# EAGLE design Anchor PCB V1 (EAGLE 9.3.0)
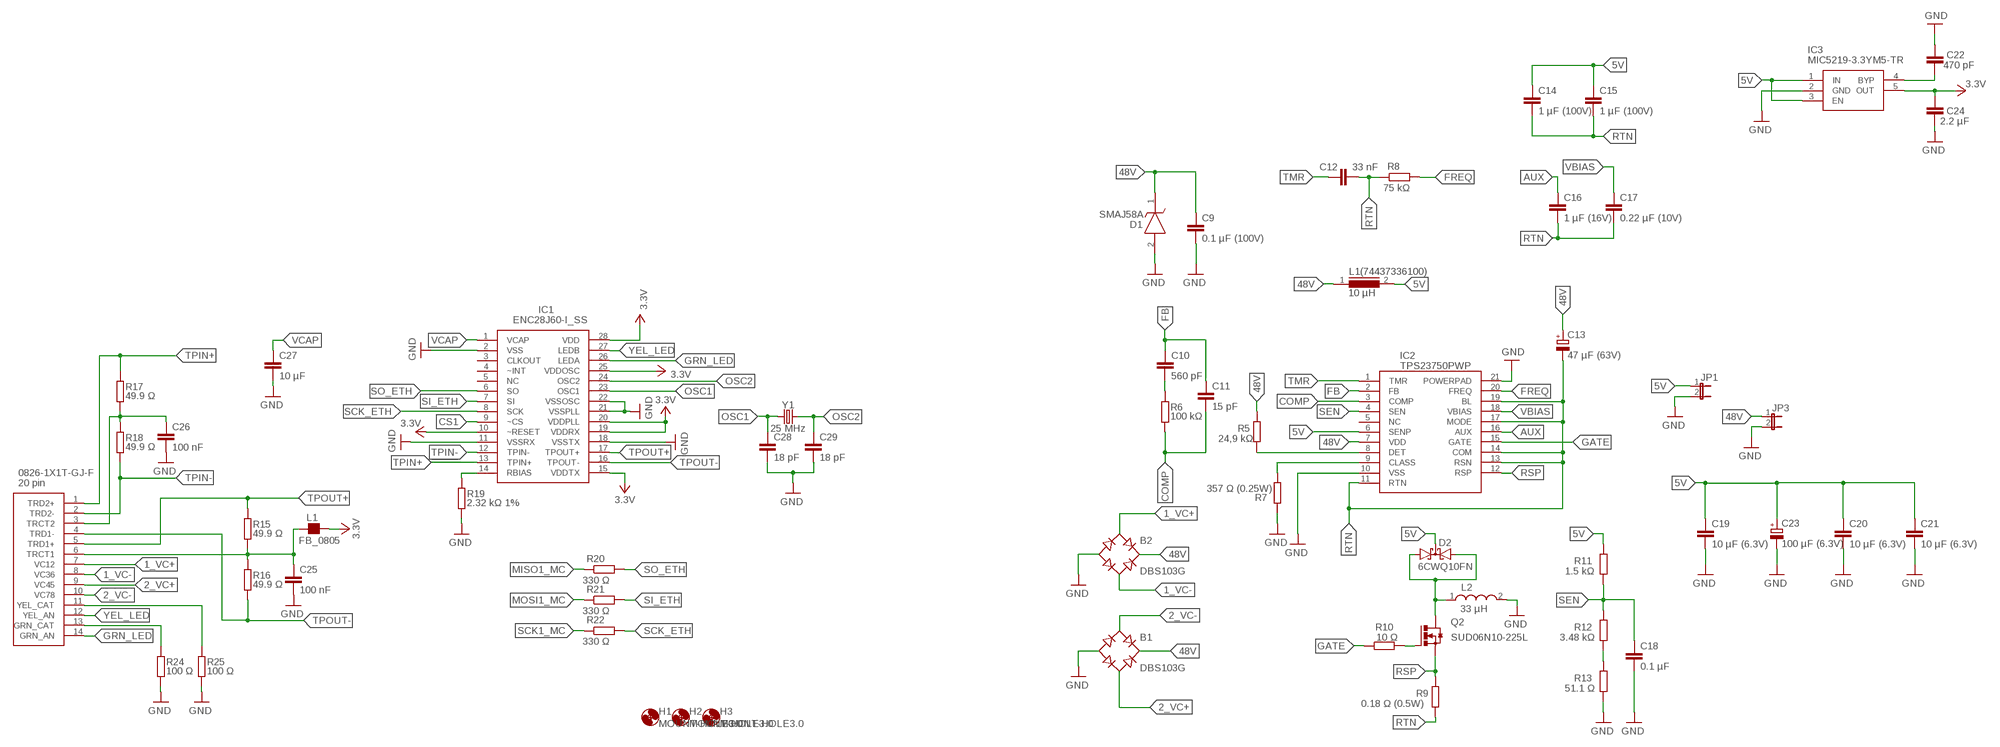
[diagram p0: schematic, sheet 1, part 1 of 2]
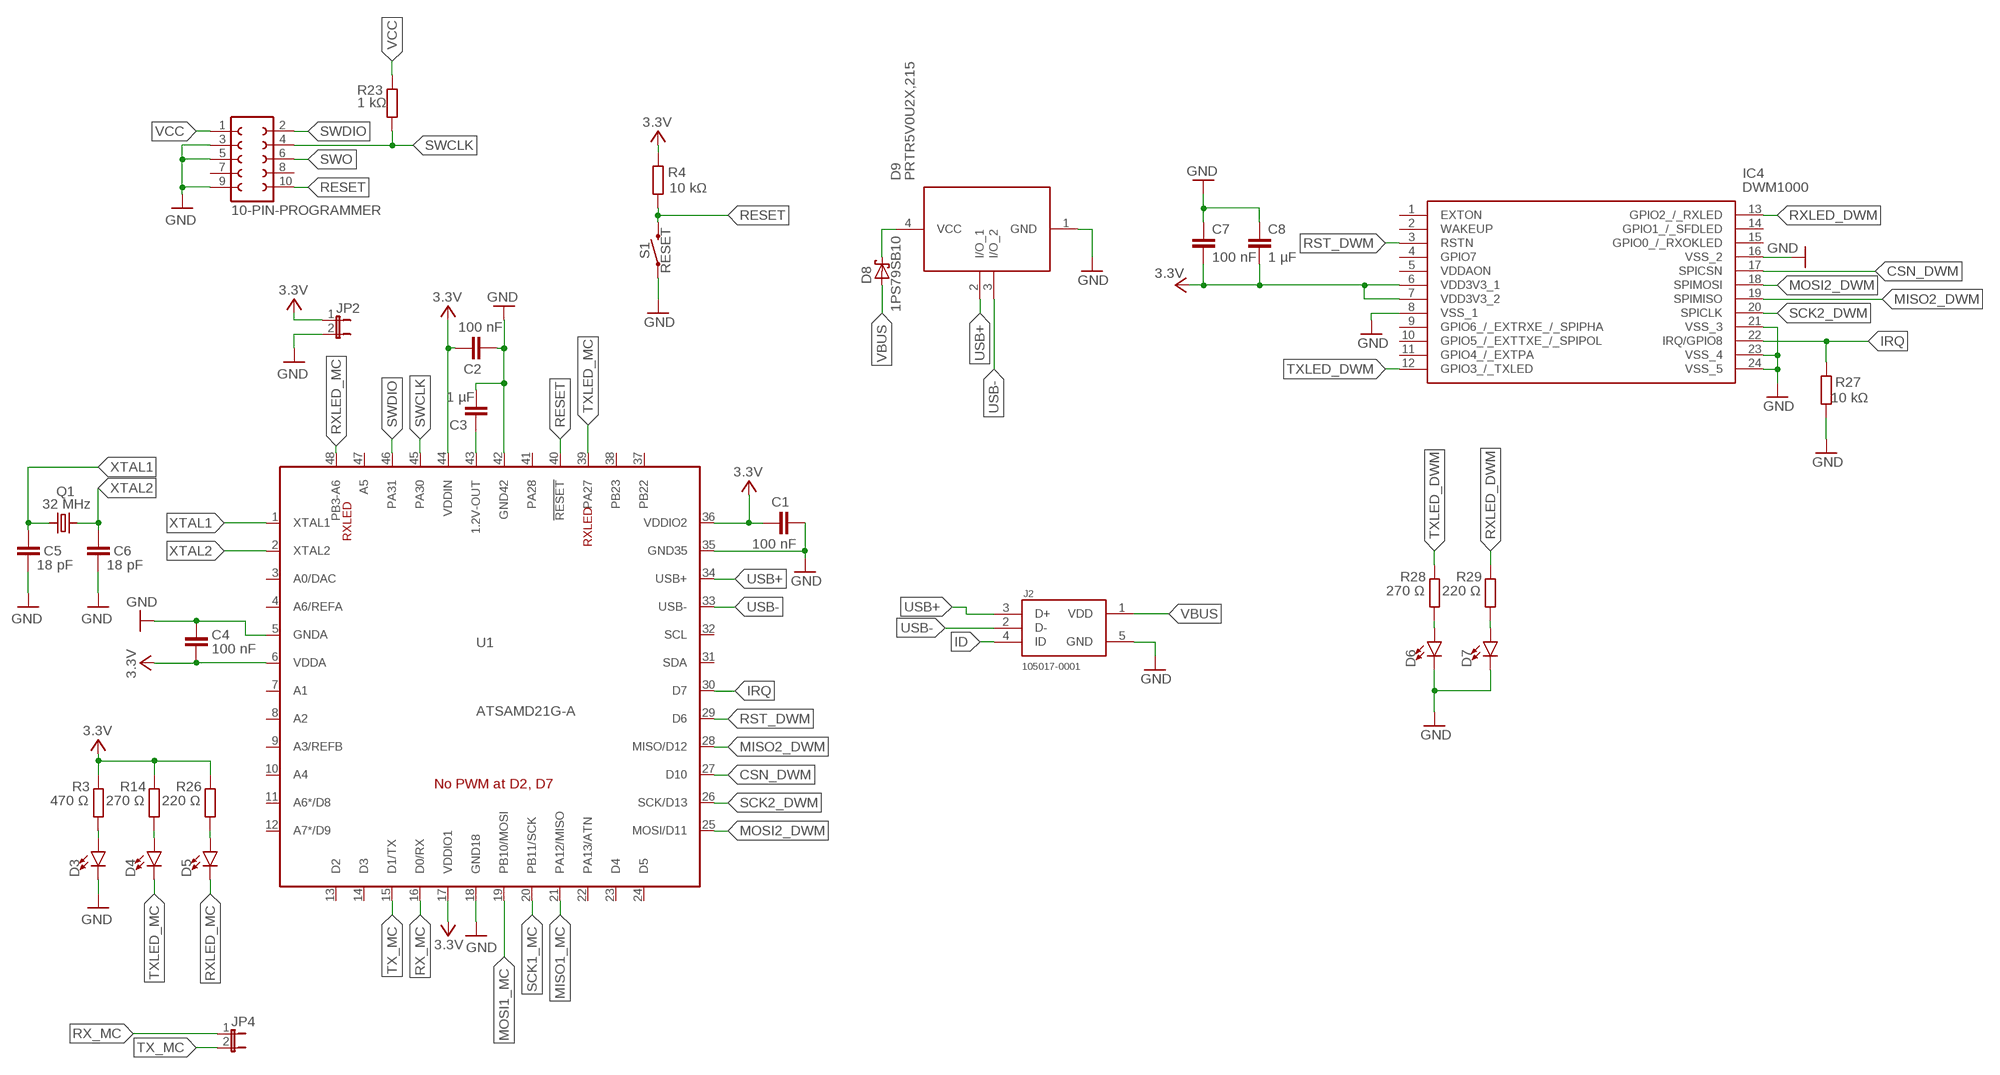
[diagram p1: schematic, sheet 1, part 2 of 2]

## Parts
10-PIN-PROGRAMMER  FE05-2  [FE05-2]
B1  DBS103G  [DBS]
B2  DBS103G  [DBS]
C1  100 nF  C-EUC0805  [C0805]
C2  100 nF  C-EUC0805  [C0805]
C3  1 µF  C-EUC0805  [C0805]
C4  100 nF  C-EUC0805  [C0805]
C5  18 pF  C-EUC0805  [C0805]
C6  18 pF  C-EUC0805  [C0805]
C7  100 nF  C-EUC0805  [C0805]
C8  1 µF  C-EUC0805  [C0805]
C9  0.1 µF (100V)  C-EUC0805  [C0805]
C10  560 pF  C-EUC0805  [C0805]
C11  15 pF  C-EUC0805  [C0805]
C12  33 nF  C-EUC0805  [C0805]
C13  47 µF (63V)  CPOL-EUE3.5-8  [E3,5-8]
C14  1 µF (100V)  C-EUC0805  [C0805]
C15  1 µF (100V)  C-EUC0805  [C0805]
C16  1 µF (16V)  C-EUC0805  [C0805]
C17  0.22 µF (10V)  C-EUC0805  [C0805]
C18  0.1 µF  C-EUC0805  [C0805]
C19  10 µF (6.3V)  C-EUC0805  [C0805]
C20  10 µF (6.3V)  C-EUC0805  [C0805]
C21  10 µF (6.3V)  C-EUC0805  [C0805]
C22  470 pF  C-EUC0805  [C0805]
C23  100 µF (6.3V)  CPOL-EUUD-6,3X7,7  [UD-6,3X7,7_NICHICON]
C24  2.2 µF  C-EUC0805  [C0805]
C25  100 nF  C-EUC0805  [C0805]
C26  100 nF  C-EUC0805  [C0805]
C27  10 µF  C-EUC0805  [C0805]
C28  18 pF  C-EUC0805  [C0805]
C29  18 pF  C-EUC0805  [C0805]
D1  SMAJ58A  [DIOM5026X229N]
D2  6CWQ10FN  BAS70-05DPAK  [DPAK]
D3  POWER  LEDCHIP-LED0805  [CHIP-LED0805]
D4  TX  LEDCHIP-LED0805  [CHIP-LED0805]
D5  RX  LEDCHIP-LED0805  [CHIP-LED0805]
D6  TX  LEDCHIP-LED0805  [CHIP-LED0805]
D7  RX  LEDCHIP-LED0805  [CHIP-LED0805]
D8  1PS79SB10  [SOD523]
D9  PRTR5V0U2X,215  [SOT-143B]
H1  MOUNT-HOLE3.0  [3,0]
H2  MOUNT-HOLE3.0  [3,0]
H3  MOUNT-HOLE3.0  [3,0]
IC1  ENC28J60-I_SS  [SOP65P780X200-28N]
IC2  TPS23750PWP  [SOP65P640X120-21N]
IC3  MIC5219-3.3YM5-TR  [SOT95P280X130-5N]
IC4  DWM1000  [DWM1000]
J1  0826-1X1T-GJ-F  [0826-1X1T-GJ-F]
J2  105017-0001  [MOLEX_105017-0001]
JP1  JP1E  [JP1]
JP2  JP1E  [JP1]
JP3  JP1E  [JP1]
JP4  JP1E  [JP1]
L1  FB_0805  [L0805]
L1(74437336100)  10 µH  DR73  [DR73]
L2  33 µH  WE-PD_1260/1245/1280/1210  [WE-PD_1260/1245/1280/1210]
Q1  32 MHz  CRYSTAL.ABS07  [ABS07]
Q2  SUD06N10-225L  N-HEXFET_SOT323-IRLL014N  [SOT223]
R3  470 Ω  R-EU_R0805  [R0805]
R4  10 kΩ  R-EU_M0805  [M0805]
R5  24,9 kΩ  R-EU_R0805  [R0805]
R6  100 kΩ  R-EU_R0805  [R0805]
R7  357 Ω (0.25W)  R-EU_R0805  [R0805]
R8  75 kΩ  R-EU_R0805  [R0805]
R9  0.18 Ω (0.5W)  R-EU_R2010  [R2010]
R10  10 Ω  R-EU_R0805  [R0805]
R11  1.5 kΩ  R-EU_R0805  [R0805]
R12  3.48 kΩ  R-EU_R0805  [R0805]
R13  51.1 Ω  R-EU_R0805  [R0805]
R14  270 Ω  R-EU_R0805  [R0805]
R15  49.9 Ω  R-EU_R0805  [R0805]
R16  49.9 Ω  R-EU_R0805  [R0805]
R17  49.9 Ω  R-EU_R0805  [R0805]
R18  49.9 Ω  R-EU_R0805  [R0805]
R19  2.32 kΩ 1%  R-EU_R0805  [R0805]
R20  330 Ω  R-EU_R0805  [R0805]
R21  330 Ω  R-EU_R0805  [R0805]
R22  330 Ω  R-EU_R0805  [R0805]
R23  1 kΩ  R-EU_R0805  [R0805]
R24  100 Ω  R-EU_R0805  [R0805]
R25  100 Ω  R-EU_R0805  [R0805]
R26  220 Ω  R-EU_R0805  [R0805]
R27  10 kΩ  R-EU_M0805  [M0805]
R28  270 Ω  R-EU_R0805  [R0805]
R29  220 Ω  R-EU_R0805  [R0805]
S1  RESET  MOMENTARY-SWITCH-SPST-SMD-4.5MM  [TACTILE_SWITCH_SMD_4.5MM]
U1  ATSAMD21G-A  [TQFP-48]
Y1  25 MHz  CRYSTALSMD-HC49UP  [HC49UP]

## Nets
1_VC+: B2.AC1 J1.7(VC12)
1_VC-: B2.AC2 J1.8(VC36)
2_VC+: B1.AC2 J1.9(VC45)
2_VC-: B1.AC1 J1.10(VC78)
5V: C14.1 C15.1 C19.1 C20.1 C21.1 C23.+ D2.4(C) IC2.6(SENP) IC3.1(IN) IC3.3(EN) JP1.1 L1(74437336100).2 R11.2
48V: B1.+ B2.+ C9.1 C13.+ D1.1(K) IC2.7(VDD) JP3.1 L1(74437336100).1 R5.2
AUX: C16.1 IC2.16(AUX)
COM_A_SHTKY: D2.1(A1) D2.3(A2) L2.1 Q2.4(D)
COMP: C11.2 IC2.3(COMP) R6.2
CS1: IC1.9(~CS)
CSN_DWM: IC4.17(SPICSN) U1.27(D10)
FB: C10.1 C11.1 IC2.2(FB)
FREQ: IC2.20(FREQ) R8.2
GATE: IC2.15(GATE) R10.1
GND: 10-PIN-PROGRAMMER.3 10-PIN-PROGRAMMER.5 10-PIN-PROGRAMMER.9 B1.- B2.- C1.2 C2.2 C3.2 C4.2 C5.2 C6.2 C7.1 C8.1 C9.2 C18.2 C19.2 C20.2 C21.2 C22.1 C23.- C24.2 C25.2 C26.2 C27.2 C28.2 C29.2 D1.2(A) D3.C D6.C D7.C D9.1(GND) IC1.2(VSS) IC1.11(VSSRX) IC1.18(VSSTX) IC1.21(VSSPLL) IC1.22(VSSOSC) IC2.10(VSS) IC2.21(POWERPAD) IC3.2(GND) IC4.8(VSS_1) IC4.16(VSS_2) IC4.21(VSS_3) IC4.23(VSS_4) IC4.24(VSS_5) J2.5(GND) JP1.2 JP2.2 JP3.2 L2.2 R7.1 R13.1 R19.2 R24.2 R25.2 R27.1 S1.2 S1.3 U1.5(GNDA) U1.18(GND18) U1.35(GND35) U1.42(GND42)
GRN_CAT: J1.13(GRN_CAT) R24.1
GRN_LED: IC1.26(LEDA) J1.14(GRN_AN)
ID: J2.4(ID)
IRQ: IC4.22(IRQ/GPIO8) R27.2 U1.30(D7)
MISO1_MC: R20.1 U1.21(PA12/MISO)
MISO2_DWM: IC4.19(SPIMISO) U1.28(MISO/D12)
MOSI1_MC: R21.1 U1.19(PB10/MOSI)
MOSI2_DWM: IC4.18(SPIMOSI) U1.25(MOSI/D11)
N$1: C3.1 U1.43(1.2V-OUT)
N$2: IC2.8(DET) R5.1
N$3: IC2.9(CLASS) R7.2
N$4: C25.1 J1.6(TRCT1) L1.1 R15.2 R16.1
N$5: C10.2 R6.1
N$6: C26.1 J1.3(TRCT2) R17.2 R18.1
N$7: Q2.1(G) R10.2
N$8: IC1.14(RBIAS) R19.1
N$9: D3.A R3.1
N$10: R12.1 R13.2
N$11: D4.A R14.1
N$12: D5.A R26.1
N$13: D6.A R28.1
N$14: D7.A R29.1
N$15: D8.1(K) D9.4(VCC)
N$18: C22.2 IC3.4(BYP)
OSC1: C28.1 IC1.23(OSC1) Y1.1
OSC2: C29.1 IC1.24(OSC2) Y1.2
RESET: 10-PIN-PROGRAMMER.10 R4.1 S1.1 S1.4 U1.40(!RESET!)
RSP: IC2.12(RSP) Q2.3(S) R9.2
RST_DWM: IC4.3(RSTN) U1.29(D6)
RTN: C12.2 C13.- C14.2 C15.2 C16.2 C17.2 IC2.11(RTN) IC2.13(RSN) IC2.14(COM) IC2.17(MODE) IC2.19(BL) R8.1 R9.1
RX_MC: JP4.1 U1.16(D0/RX)
RXLED_DWM: IC4.13(GPIO2_/_RXLED) R29.2
RXLED_MC: D5.C U1.48(PB3-A6)
SCK1_MC: R22.1 U1.20(PB11/SCK)
SCK2_DWM: IC4.20(SPICLK) U1.26(SCK/D13)
SCK_ETH: IC1.8(SCK) R22.2
SEN: C18.1 IC2.4(SEN) R11.1 R12.2
SI_ETH: IC1.7(SI) R21.2
SO_ETH: IC1.6(SO) R20.2
SWCLK: 10-PIN-PROGRAMMER.4 R23.1 U1.45(PA30)
SWDIO: 10-PIN-PROGRAMMER.2 U1.46(PA31)
SWO: 10-PIN-PROGRAMMER.6
TMR: C12.1 IC2.1(TMR)
TPIN+: IC1.13(TPIN+) J1.1(TRD2+) R17.1
TPIN-: IC1.12(TPIN-) J1.2(TRD2-) R18.2
TPOUT+: IC1.17(TPOUT+) J1.5(TRD1+) R15.1
TPOUT-: IC1.16(TPOUT-) J1.4(TRD1-) R16.2
TX_MC: JP4.2 U1.15(D1/TX)
TXLED_DWM: IC4.12(GPIO3_/_TXLED) R28.2
TXLED_MC: D4.C U1.39(PA27)
USB+: D9.2(I/O_1) J2.3(D+) U1.34(USB+)
USB-: D9.3(I/O_2) J2.2(D-) U1.33(USB-)
VBIAS: C17.1 IC2.18(VBIAS)
VBUS: D8.2(A) J2.1(VDD)
VCAP: C27.1 IC1.1(VCAP)
VCC: 10-PIN-PROGRAMMER.1 C1.1 C2.1 C4.1 C7.2 C8.2 C24.1 IC1.10(~RESET) IC1.15(VDDTX) IC1.19(VDDRX) IC1.20(VDDPLL) IC1.25(VDDOSC) IC1.28(VDD) IC3.5(OUT) IC4.6(VDD3V3_1) IC4.7(VDD3V3_2) JP2.1 L1.2 R3.2 R4.2 R14.2 R23.2 R26.2 U1.6(VDDA) U1.17(VDDIO1) U1.36(VDDIO2) U1.44(VDDIN) ; supply symbol labelled 3.3V
XTAL1: C5.1 Q1.2 U1.1(XTAL1)
XTAL2: C6.1 Q1.1 U1.2(XTAL2)
YEL_CAT: J1.11(YEL_CAT) R25.1
YEL_LED: IC1.27(LEDB) J1.12(YEL_AN)
Unconnected: 10-PIN-PROGRAMMER.7 10-PIN-PROGRAMMER.8 IC1.3(CLKOUT) IC1.4(~INT) IC1.5(NC) IC2.5(NC) IC4.1(EXTON) IC4.2(WAKEUP) IC4.4(GPIO7) IC4.5(VDDAON) IC4.9(GPIO6_/_EXTRXE_/_SPIPHA) IC4.10(GPIO5_/_EXTTXE_/_SPIPOL) IC4.11(GPIO4_/_EXTPA) IC4.14(GPIO1_/_SFDLED) IC4.15(GPIO0_/_RXOKLED) U1.3(A0/DAC) U1.4(A6/REFA) U1.7(A1) U1.8(A2) U1.9(A3/REFB) U1.10(A4) U1.11(A6*/D8) U1.12(A7*/D9) U1.13(D2) U1.14(D3) U1.22(PA13/ATN) U1.23(D4) U1.24(D5) U1.31(SDA) U1.32(SCL) U1.37(PB22) U1.38(PB23) U1.41(PA28) U1.47(A5)

## Library data of the parts
10-PIN-PROGRAMMER = con-lsta:FE05-2: FEMALE HEADER; OC_FARNELL: unknown; OC_NEWARK: unknown
B1 B2 = rectifier:DB?*G: Single Phase 1.0 AMP Glass Passivated Bridge Rectifier Taiwan Semiconductor Co.,Ltd. - TSC Source: http://www.taiwansemi.com/TSCbig5/ezcatfiles/cust/img/img/db101g.pdf http://www.ts.com.tw/db/pictures/modules/PDT/PDT060207001/DBLS201G.pdf
C1-C12 C14-C22 C24-C29 = rcl:C-EU: CAPACITOR, European symbol; SPICEPREFIX: C
C13 C23 = rcl:CPOL-EU: POLARIZED CAPACITOR, European symbol; SPICEPREFIX: C
D1 = SMAJ58A:SMAJ58A: Littelfuse SMAJ58A Uni-Directional TVS Diode, 400W peak, 2-Pin DO-214AC Source: Datasheet <https://componentsearchengine.com/Datasheets/2/SMAJ58A.pdf>; DESCRIPTION: Littelfuse SMAJ58A Uni-Directional TVS Diode, 400W peak, 2-Pin DO-214AC; HEIGHT: 2.29mm; MANUFACTURER_NAME: LITTELFUSE; MANUFACTURER_PART_NUMBER: SMAJ58A; MOUSER_PART_NUMBER: 576-SMAJ58A; MOUSER_PRICE-STOCK: https://www.mouser.com/Search/Refine.aspx?Keyword=576-SMAJ58A; RS_PART_NUMBER: 7645562P; RS_PRICE-STOCK: http://uk.rs-online.com/web/p/products/7645562P
D2 = shottky:BAS70-05: Silicon Schottky Diodes General-purpose diode for high-speed switching
D3-D7 = led:LED: LED OSRAM: - CHIPLED LG R971, LG N971, LY N971, LG Q971, LY Q971, LO R971, LY R971 LH N974, LH R974 LS Q976, LO Q976, LY Q976 LO Q996 - Hyper CHIPLED LW Q18S LB Q993, LB Q99A, LB R99A - SideLED LS A670, LO A670, LY A670, LG A670, LP A670 LB A673, LV A673, LT A673, LW A673 LH A674 LY A675 LS A676, LA A676, LO A676, LY A676, LW A676 LS A679, LY A679, LG A679 - Hyper Micro SIDELED® LS Y876, LA Y876, LO Y876, LY Y876 LT Y87S - SmartLED LW L88C, LW L88S LB L89C, LB L89S, LG L890 LS L89K, LO L89K, LY L89K LS L896, LA L896, LO L896, LY L896 - TOPLED LS T670, LO T670, LY T670, LG T670, LP T670 LSG T670, LSP T670, LSY T670, LOP T670, LYG T670 LG T671, LOG T671, LSG T671 LB T673, LV T673, LT T673, LW T673 LH T674 LS T676, LA T676, LO T676, LY T676, LB T676, LH T676, LSB T676, LW T676 LB T67C, LV T67C, LT T67C, LS T67K, LO T67K, LY T67K, LW E67C LS E67B, LA E67B, LO E67B, LY E67B, LB E67C, LV E67C, LT E67C LW T67C LS T679, LY T679, LG T679 LS T770, LO T770, LY T770, LG T770, LP T770 LB T773, LV T773, LT T773, LW T773 LH T774 LS E675, LA E675, LY E675, LS T675 LS T776, LA T776, LO T776, LY T776, LB T776 LHGB T686 LT T68C, LB T68C - Hyper Mini TOPLED® LB M676 - Mini TOPLED Santana® LG M470 LS M47K, LO M47K, LY M47K Source: http://www.osram.convergy.de LUXEON: - LUMILED® LXK2-PW12-R00, LXK2-PW12-S00, LXK2-PW14-U00, LXK2-PW14-V00 LXK2-PM12-R00, LXK2-PM12-S00, LXK2-PM14-U00 LXK2-PE12-Q00, LXK2-PE12-R00, LXK2-PE12-S00, LXK2-PE14-T00, LXK2-PE14-U00 LXK2-PB12-K00, LXK2-PB12-L00, LXK2-PB12-M00, LXK2-PB14-N00, LXK2-PB14-P00, LXK2-PB14-Q00 LXK2-PR12-L00, LXK2-PR12-M00, LXK2-PR14-Q00, LXK2-PR14-R00 LXK2-PD12-Q00, LXK2-PD12-R00, LXK2-PD12-S00 LXK2-PH12-R00, LXK2-PH12-S00 LXK2-PL12-P00, LXK2-PL12-Q00, LXK2-PL12-R00 Source: www.luxeon.com KINGBRIGHT: KA-3528ASYC Source: www.kingbright.com
D8 = nxp_60_1_1:1PS79SB10: Schottky barrier diode Planar Schottky barrier diode encapsulated in a SC-79 ultra small plastic SMD package. AAL Eindhoven MK
D9 = PRTR5V0U2X_215:PRTR5V0U2X,215: ESD Protection Diodes 5.5V Dual SOT143B NXP PRTR5V0U2X,215 Dual Uni-Directional TVS Diode, 4-Pin SOT-143B Source: Datasheet <http://docs-emea.rs-online.com/webdocs/0f75/0900766b80f751d4.pdf>; DESCRIPTION: ESD Protection Diodes 5.5V Dual SOT143B NXP PRTR5V0U2X,215 Dual Uni-Directional TVS Diode, 4-Pin SOT-143B; HEIGHT: mm; MANUFACTURER_NAME: Nexperia; MANUFACTURER_PART_NUMBER: PRTR5V0U2X,215; MOUSER_PART_NUMBER: 771-PRTR5V0U2X-T/R; MOUSER_PRICE-STOCK: https://www.mouser.com/Search/Refine.aspx?Keyword=771-PRTR5V0U2X-T%2FR; RS_PART_NUMBER: 7258720P; RS_PRICE-STOCK: http://uk.rs-online.com/web/p/products/7258720P
H1-H3 = holes:MOUNT-HOLE: MOUNTING HOLE with drill center marker
IC1 = ENC28J60-I_SS:ENC28J60-I_SS: Stand-Alone Ethernet Controller Source: Datasheet <http://componentsearchengine.com/Datasheets/3/ENC28J60-I_SS.pdf>; ALLIED_NUMBER: 70047510; ALLIED_PRICE-STOCK: https://www.alliedelec.com/microchip-technology-inc-enc28j60-i-ss/70047510/; ARROW_PART_NUMBER: ENC28J60-I/SS; ARROW_PRICE-STOCK: https://www.arrow.com/en/products/enc28j60-iss/microchip-technology; DESCRIPTION: Stand-Alone Ethernet Controller; HEIGHT: mm; MANUFACTURER_NAME: Microchip; MANUFACTURER_PART_NUMBER: ENC28J60-I/SS; RS_PART_NUMBER: 7707755P; RS_PRICE-STOCK: http://uk.rs-online.com/web/p/products/7707755P
IC2 = TPS23750PWP:TPS23750PWP: Texas Instruments TPS23750PWP, DC-DC Controller, 20-Pin, HTSSOP Source: Datasheet <http://www.ti.com/lit/gpn/TPS23750>; DESCRIPTION: Texas Instruments TPS23750PWP, DC-DC Controller, 20-Pin, HTSSOP; HEIGHT: mm; MANUFACTURER_NAME: Texas Instruments; MANUFACTURER_PART_NUMBER: TPS23750PWP; MOUSER_PART_NUMBER: 595-TPS23750PWP; MOUSER_PRICE-STOCK: https://www.mouser.com/Search/Refine.aspx?Keyword=595-TPS23750PWP; RS_PART_NUMBER: 6200824; RS_PRICE-STOCK: https://uk.rs-online.com/web/p/products/6200824
IC3 = MIC5219-3.3YM5-TR:MIC5219-3.3YM5-TR: LDO Regulator Pos 3.3V 0.5A Microchip MIC5219-3.3YM5-TR, LDO Voltage Regulator, 500mA, 3.3 V +/-2%, 2.5 12 Vin, 5-Pin SOT-23 Source: Datasheet <http://www.microchip.com/mymicrochip/filehandler.aspx?ddocname=en579712>; DESCRIPTION: LDO Regulator Pos 3.3V 0.5A Microchip MIC5219-3.3YM5-TR, LDO Voltage Regulator, 500mA, 3.3 V +/-2%, 2.5 12 Vin, 5-Pin SOT-23; HEIGHT: 1.3mm; MANUFACTURER_NAME: Microchip; MANUFACTURER_PART_NUMBER: MIC5219-3.3YM5-TR; MOUSER_PART_NUMBER: 998-MIC5219-3.3YM5TR; RS_PART_NUMBER: 9101685P; RS_PRICE-STOCK: http://uk.rs-online.com/web/p/products/9101685P
IC4 = DWM1000:DWM1000: IEEE 802.15.4-2011 UWB Transceiver Module Source: Datasheet <http://www.decawave.com/sites/default/files/resources/dwm1000-datasheet-v1.3.pdf>; ARROW_PART_NUMBER: DWM1000; DESCRIPTION: IEEE 802.15.4-2011 UWB Transceiver Module; HEIGHT: mm; MANUFACTURER_NAME: Decawave; MANUFACTURER_PART_NUMBER: DWM1000
J1 = 0826-1X1T-GJ-F:0826-1X1T-GJ-F: Magjack POE+ 10/100 tab up Y/GO LEDS Bel-Stewart MagJack, RJ45 Modular Jack Socket, STP, Straight, Through Hole Source: Datasheet <http://uk.rs-online.com/web/p/products/7418562>; ALLIED_NUMBER: R1013706; ALLIED_PRICE-STOCK: https://www.alliedelec.com/stewart-connectors-0826-1x1t-gj-f/R1013706/; DESCRIPTION: Magjack POE+ 10/100 tab up Y/GO LEDS Bel-Stewart MagJack, RJ45 Modular Jack Socket, STP, Straight, Through Hole; HEIGHT: mm; MANUFACTURER_NAME: Bel-Stewart; MANUFACTURER_PART_NUMBER: 0826-1X1T-GJ-F; MOUSER_PART_NUMBER: 530-0826-1X1T-GJ-F; RS_PART_NUMBER: 7418562; RS_PRICE-STOCK: https://uk.rs-online.com/web/p/products/7418562
J2 = 105017-0001:105017-0001; AVAILABILITY: Unavailable; DESCRIPTION: Conn USB Type B M 5 POS 0.65mm Solder RA Thru-Hole 5 Terminal 1 Port Embossed T/R; MF: Molex; MP: 105017-0001; PACKAGE: None; PRICE: None
JP1-JP4 = jumper:JP1E: JUMPER
L1 = rc-master-smd:FB_: FERRITE BEAD
L1(74437336100) = inductors:DR73: High Power Density, High Efficiency, Shielded Inductors Source: coiltronics_dr_series.pdf; SPICEPREFIX: L
L2 = wurth_elektronik_passive_rev16d:WE-PD: SMD Shielded Power Inductor Characteristics Magnetically shielded version which results in a low leakage field High Saturation currents up to 25 A Very low self-losses at high switching frequency‘s Wide inductances spectrum available at all sizes Operating temperature: –40 °C to +125 °C Applications Perfectly suitable for switching regulators with extremely high efficiency Integrated DC/DC- converter Switching regulators with low operating voltages (Graphic cards, embedded PC-Cards, Mainboards) Plastic base: Because of the one piece construction these are more suitable for high vibration or shock applications <http://katalog.we-online.de/media/images/eisos/FePBF_pf2.jpg> Details see: http://katalog.we-online.de/en/pbs/WE-PD? Updated by Dan Xu 2014-07-08 2014 (C) Wurth Elektronik
Q1 = abracon:CRYSTAL
Q2 = transistor-power:N-HEXFET_?-*: HEXFET® Power MOSFET
R3-R29 = rcl:R-EU_: RESISTOR, European symbol; SPICEPREFIX: R
S1 = SparkFun-Switches:MOMENTARY-SWITCH-SPST: Momentary Switch (Pushbutton) - SPST Normally-open (NO) SPST momentary switches (buttons, pushbuttons). Variants PTH-12MM - 12mm square, through-hole Momentary Pushbutton Switch - 12mm Square <https://www.sparkfun.com/products/9190> (COM-09190) PTH-6.0MM, PTH-6.0MM-KIT - 6.0mm square, through-hole Mini Pushbutton Switch <https://www.sparkfun.com/products/97> (COM-00097) KIT package intended for soldering kit's - only one side of pads' copper is exposed. PTH-RIGHT-ANGLE-KIT - Right-angle, through-hole Right Angle Tactile Button <https://www.sparkfun.com/products/10791> - Used on SparkFun BigTime Watch Kit <https://www.sparkfun.com/products/11734> SMD-12MM - 12mm square, surface-mount Tactile Button - SMD (12mm) <https://www.sparkfun.com/products/12993> (COM-12993) Used on SparkFun PicoBoard <https://www.sparkfun.com/products/11888> SMD-4.5MM - 4.5mm Square Trackball Switch Used on SparkFun Blackberry Trackballer Breakout <https://www.sparkfun.com/products/13169> SMD-4.6MMX2.8MM - 4.60mm x 2.80mm, surface mount Used on SparkFun SAMD21 Mini Breakout <https://www.sparkfun.com/products/13664> SMD-5.2MM, SMD-5.2-REDUNDANT - 5.2mm square, surface-mount Mini Pushbutton Switch - SMD <https://www.sparkfun.com/products/8720> (COM-08720) Used on Arduino Pro Mini <https://www.sparkfun.com/products/11114> REDUNDANT package connects both switch circuits together SMD-6.0X3.5MM - 6.0 x 3.5mm, surface mount Momentary Reset Switch SMD <https://www.sparkfun.com/products/8229> (COM-08229) SMD-6.2MM-TALL - 6.2mm square, surface mount Tactile Button - SMD (6mm) <https://www.sparkfun.com/products/12992> Used on SparkFun Digital Sandbox <https://www.sparkfun.com/products/12651> SMD-RIGHT-ANGLE - Right-angle, surface mount Used on SparkFun Block for Intel® Edison - Arduino <https://www.sparkfun.com/products/13036>; PROD_ID: SWCH-09213
U1 = MicroControl:ATSAMD21G: Atmel SAMD21G SMART ARM-Based Microcontroller The Atmel ® | SMART  SAM D21 is a series of low-power microcontrollers using the 32-bit ARM ® Cortex ® -M0+ processor, and ranging from 32- to 64-pins with up to 256KB Flash and 32KB of SRAM. The SAM D21 devices operate at a maximum frequency of 48MHz and reach 2.46 CoreMark/MHz. They are designed for simple and intuitive migration with identical peripheral modules, hex compatible code, identical linear address map and pin compatible migration paths between all devices in the product series. All devices include intelligent and flexible peripherals, Atmel Event System for inter-peripheral signaling, and support for capacitive touch button, slider and wheel user interfaces.; PROD_ID: IC-13064
Y1 = SparkFun-Clocks:CRYSTAL: Crystals (Generic) These are passive quartz crystals, which can be used as a clock source for a microcontroller. Crystal's are two-terminal devices. They require external "load" capacitors to generate an oscillating signal.

## Board
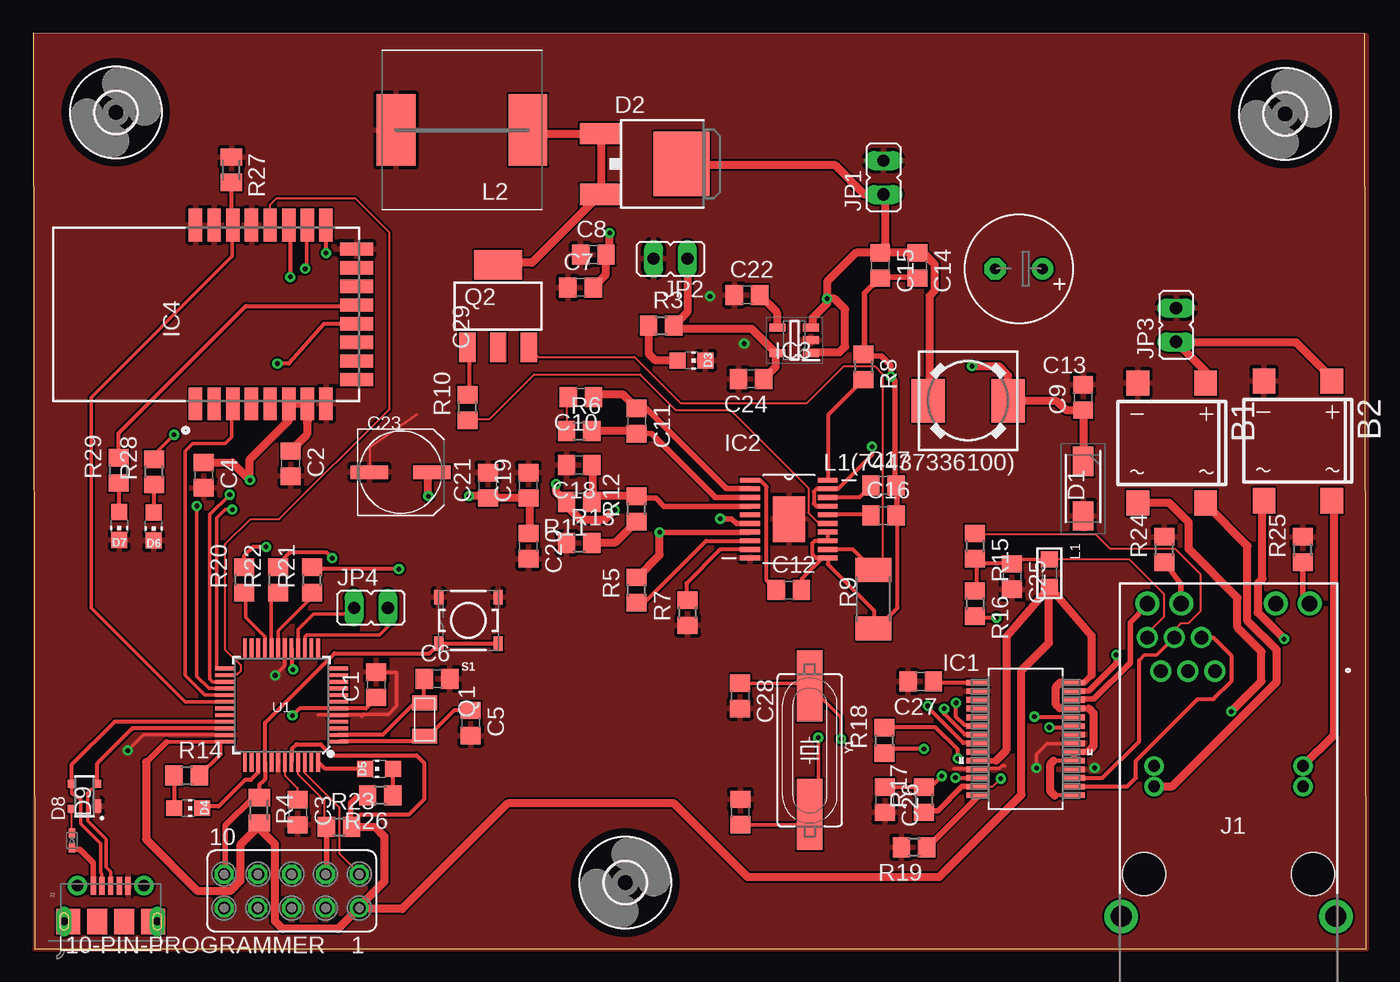
[diagram p2: board, top side]
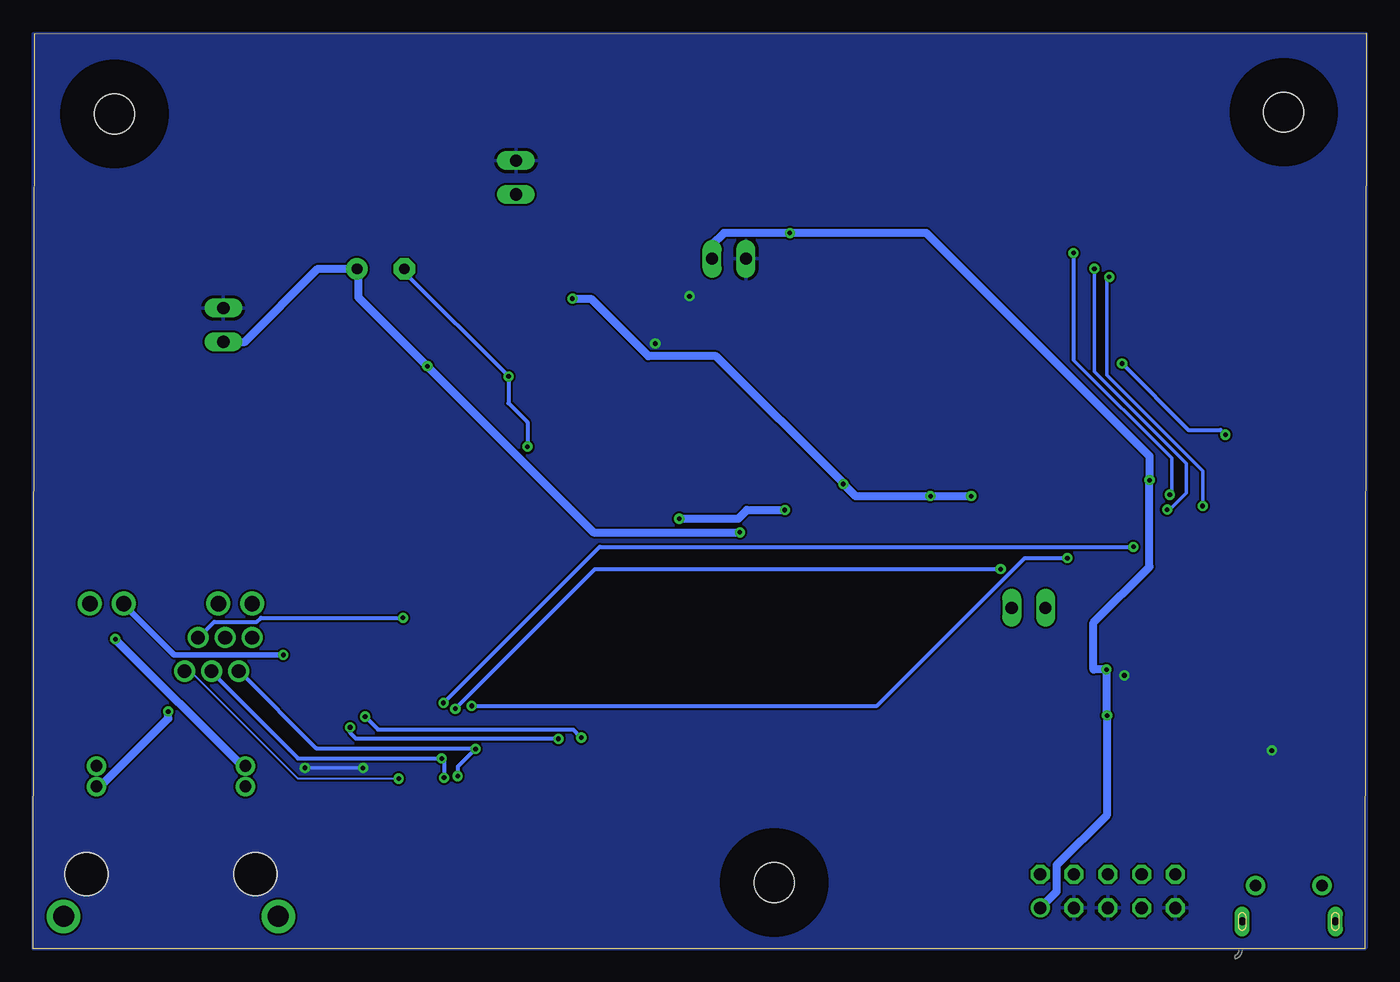
[diagram p3: board, bottom side, seen from below]

Size 100.1 x 68.75 mm. Coordinates in mm from the lower left corner, seen from the top.
Outline: 0.1,0 100.1,0 100,68.72 0,68.75 0.1,0
Copper layers (1*16): Top 0.035mm / dielectric 1.5mm / Bottom 0.035mm
Design rules "default *": minimum track width 6mil, minimum drill 0.35mm, track to track 6mil, track to pad 6mil, pad to pad 6mil, via to via 6mil, smd to smd 6mil, copper to edge 0mil, drill to drill 6mil, minimum pad ring 10mil, minimum via ring 8mil, stop-mask expansion 4mil, vias tented up to drill 0mil, thermal gap 10mil

### Footprints (pad centres in the part's own frame; a part is rotated, then mirrored left to right if it is on the bottom)
FE05-2 = drill 0.914: 1 -5.08,1.27 | drill 0.914 octagon: 2 -5.08,-1.27; 3 -2.54,1.27; 4 -2.54,-1.27; 5 0,1.27; 6 0,-1.27; 7 2.54,1.27; 8 2.54,-1.27; 9 5.08,1.27; 10 5.08,-1.27
DBS = smd 1.7 x 1.9: + -2.55,-4.5; - 2.55,-4.5; AC1 -2.55,4.5; AC2 2.55,4.5
C0805 = smd 1.3 x 1.5: 1 -0.95,0; 2 0.95,0
E3,5-8 = drill 0.813 pad 1.6: + -1.778,0 | drill 0.813 pad 1.6 octagon: - 1.778,0
UD-6,3X7,7_NICHICON = smd 2.8 x 1: + 2.35,0; - -2.35,0
DIOM5026X229N = smd 2.2 x 1.55: 1 -2.05,0; 2 2.05,0
DPAK = smd 1.6 x 3: 1 -2.28,-4.04; 3 2.28,-4.04 | smd 4.826 x 4.191: 4 0,2.096
CHIP-LED0805 = smd 1.2 x 1.2: A 0,-1.05; C 0,1.05
SOD523 = smd 0.7 x 0.5: 1 0.55,0; 2 -0.55,0
SOT-143B = smd 1 x 0.6: 1 -0.75,-0.95 | smd 0.6 x 0.6: 2 0.95,-0.95; 3 0.95,0.95; 4 -0.95,0.95
3,0 = hole 3: 0,0
SOP65P780X200-28N = smd 1.651 x 0.432: 1 -3.632,4.216; 2 -3.632,3.581; 3 -3.632,2.921; 4 -3.632,2.286; 5 -3.632,1.626; 6 -3.632,0.965; 7 -3.632,0.33; 8 -3.632,-0.33; 9 -3.632,-0.965; 10 -3.632,-1.626; 11 -3.632,-2.286; 12 -3.632,-2.921; 13 -3.632,-3.581; 14 -3.632,-4.216; 15 3.632,-4.216; 16 3.632,-3.581; 17 3.632,-2.921; 18 3.632,-2.286; 19 3.632,-1.626; 20 3.632,-0.965; 21 3.632,-0.33; 22 3.632,0.33; 23 3.632,0.965; 24 3.632,1.626; 25 3.632,2.286; 26 3.632,2.921; 27 3.632,3.581; 28 3.632,4.216
SOP65P640X120-21N = smd 1.473 x 0.356: 1 -2.921,2.921; 2 -2.921,2.286; 3 -2.921,1.626; 4 -2.921,0.965; 5 -2.921,0.33; 6 -2.921,-0.33; 7 -2.921,-0.965; 8 -2.921,-1.626; 9 -2.921,-2.286; 10 -2.921,-2.921; 11 2.921,-2.921; 12 2.921,-2.286; 13 2.921,-1.626; 14 2.921,-0.965; 15 2.921,-0.33; 16 2.921,0.33; 17 2.921,0.965; 18 2.921,1.626; 19 2.921,2.286; 20 2.921,2.921 | smd 2.388 x 3.404: 21 0,0
SOT95P280X130-5N = smd 1.2 x 0.6: 1 -1.25,0.95; 2 -1.25,0; 3 -1.25,-0.95; 4 1.25,-0.95; 5 1.25,0.95
DWM1000 = smd 2.45 x 1: 1 -6.705,12.3; 2 -6.705,10.9; 3 -6.705,9.5; 4 -6.705,8.1; 5 -6.705,6.7; 6 -6.705,5.3; 7 -6.705,3.9; 8 -6.705,2.5; 17 6.705,2.5; 18 6.705,3.9; 19 6.705,5.3; 20 6.705,6.7; 21 6.705,8.1; 22 6.705,9.5; 23 6.705,10.9; 24 6.705,12.3 | smd 1 x 2.45: 9 -4.9,0.205; 10 -3.5,0.205; 11 -2.1,0.205; 12 -0.7,0.205; 13 0.7,0.205; 14 2.1,0.205; 15 3.5,0.205; 16 4.9,0.205
0826-1X1T-GJ-F = drill 1.02 pad 1.6: 1 1.025,-26.16; 2 3.055,-26.16; 3 5.085,-26.16; 4 2.04,-28.7; 5 4.07,-28.7; 6 6.1,-28.7 | drill 0.89 pad 1.45: 7 -5.59,-19.05; 8 5.59,-19.05; 9 -5.59,-17.51; 10 5.59,-17.51 | drill 1.15 pad 1.8: 11 -6.09,-31.24; 12 -3.55,-31.24; 13 3.56,-31.24; 14 6.1,-31.24 | drill 1.57 pad 2.5: 17 -8.065,-7.75; 18 8.065,-7.75 | hole 3.25: -6.35,-10.92; 6.35,-10.92
MOLEX_105017-0001 = smd 0.4 x 1.35: 1 -1.3,2.675; 2 -0.65,2.675; 3 0,2.675; 4 0.65,2.675; 5 1.3,2.675 | drill 0.85 pad 1.45: P$1 -2.5,2.7; P$2 2.5,2.7 | smd 1.5 x 1.9: P$8 -1,0; P$9 1,0 | smd 1.8 x 1.9: P$10 -3.2,0; P$11 3.2,0 | drill 0.6 pad 0.8 long: P$12 -3.5,0; P$13 3.5,0
JP1 = drill 0.914 long: 1 0,-1.27; 2 0,1.27
L0805 = smd 1.2 x 1.3: 1 -1.016,0; 2 1.016,0
DR73 = smd 2.5 x 3.25: 1 -3,0; 2 3,0
WE-PD_1260/1245/1280/1210 = smd 2.9 x 5.4: 1 -4.95,0; 2 4.95,0
ABS07 = smd 1.1 x 1.9: 1 -1.25,0; 2 1.25,0
SOT223 = smd 1.219 x 2.235: 1 -2.311,-3.099; 2 0,-3.099; 3 2.311,-3.099 | smd 3.6 x 2.2: 4 0,3.099
R0805 = smd 1.3 x 1.5: 1 -0.95,0; 2 0.95,0
M0805 = smd 1.3 x 1.6: 1 -0.95,0; 2 0.95,0
R2010 = smd 1.8 x 2.7: 1 -2.2,0; 2 2.2,0
TACTILE_SWITCH_SMD_4.5MM = smd 0.7 x 1.1: 1 2.225,1.75; 2 2.225,-1.75; 3 -2.225,-1.75; 4 -2.225,1.75
TQFP-48 = smd 1.5 x 0.28: 1 -4.25,2.75; 2 -4.25,2.25; 3 -4.25,1.75; 4 -4.25,1.25; 5 -4.25,0.75; 6 -4.25,0.25; 7 -4.25,-0.25; 8 -4.25,-0.75; 9 -4.25,-1.25; 10 -4.25,-1.75; 11 -4.25,-2.25; 12 -4.25,-2.75; 25 4.25,-2.75; 26 4.25,-2.25; 27 4.25,-1.75; 28 4.25,-1.25; 29 4.25,-0.75; 30 4.25,-0.25; 31 4.25,0.25; 32 4.25,0.75; 33 4.25,1.25; 34 4.25,1.75; 35 4.25,2.25; 36 4.25,2.75 | smd 0.28 x 1.5: 13 -2.75,-4.25; 14 -2.25,-4.25; 15 -1.75,-4.25; 16 -1.25,-4.25; 17 -0.75,-4.25; 18 -0.25,-4.25; 19 0.25,-4.25; 20 0.75,-4.25; 21 1.25,-4.25; 22 1.75,-4.25; 23 2.25,-4.25; 24 2.75,-4.25; 37 2.75,4.25; 38 2.25,4.25; 39 1.75,4.25; 40 1.25,4.25; 41 0.75,4.25; 42 0.25,4.25; 43 -0.25,4.25; 44 -0.75,4.25; 45 -1.25,4.25; 46 -1.75,4.25; 47 -2.25,4.25; 48 -2.75,4.25
HC49UP = smd 5.334 x 1.93: 1 -4.826,0; 2 4.826,0

### Placement (x,y rotation side)
10-PIN-PROGRAMMER  19.41,4.32 180 top
B1  85.5,37.97 180 top
B2  94.97,38.13 180 top
C1  25.76,19.81 90 top
C2  19.33,36.43 270 top
C3  19.86,10.24 270 top
C4  12.8,35.56 270 top
C5  32.84,16.94 270 top
C6  30.33,20.26 0 top
C7  41.1,49.66 0 top
C8  42.06,52.12 0 top
C9  78.84,41.4 90 top
C10  41.13,41.41 180 top
C11  45.31,39.62 270 top
C12  56.74,26.92 0 top
C13  74.02,51.05 180 top
C14  66.4,51.31 270 top
C15  63.6,51.31 270 top
C16  63.86,32.51 0 top
C17  63.86,34.8 0 top
C18  41,36.32 180 top
C19  37.19,34.8 90 top
C20  37.19,30.23 270 top
C21  34.14,34.8 90 top
C22  53.59,49.1 0 top
C23  27.59,35.79 0 top
C24  53.91,42.79 180 top
C25  73.51,27.94 270 top
C26  63.95,11.18 270 top
C27  66.65,20.07 180 top
C28  53.08,18.98 270 top
C29  53.1,10.26 90 top
D1  78.84,34.54 270 top
D2  46.58,58.93 270 top
D3  49.44,44.18 270 top
D4  11.63,10.55 270 top
D5  25.98,13.5 90 top
D6  9.03,31.69 180 top
D7  6.46,31.74 180 top
D8  2.9,8.13 90 top
D9  3.85,11.44 90 top
H1  44.45,4.95 0 top
H2  6.2,62.81 0 top
H3  94.01,62.69 0 top
IC1  74.52,15.75 0 top
IC2  56.74,32.26 0 top
IC3  57.15,45.69 180 top
IC4  24.49,47.63 90 top
J1  89.76,-5.33 180 top
J2  5.82,2.03 0 top
JP1  63.86,57.91 0 top
JP2  47.85,51.82 90 top
JP3  85.83,46.84 0 top
JP4  25.36,25.59 270 top
L1  76.3,28.19 270 top
L1(74437336100)  70.21,41.15 180 top
L2  32.2,61.49 180 top
Q1  29.39,17.21 270 top
Q2  34.9,48.26 0 top
R3  47.16,46.8 0 top
R4  16.97,10.39 270 top
R5  45.31,26.92 90 top
R6  41,38.86 0 top
R7  49.15,25.22 90 top
R8  62.33,43.69 270 top
R9  63.09,26.25 90 top
R10  32.61,40.64 90 top
R11  41,33.53 180 top
R12  45.31,33.02 90 top
R13  41,30.48 0 top
R14  11.52,12.99 0 top
R15  70.71,30.23 270 top
R16  70.71,25.91 270 top
R17  66.9,11.18 90 top
R18  63.91,15.64 90 top
R19  66.14,7.62 180 top
R20  15.85,27.69 90 top
R21  20.93,27.69 90 top
R22  18.39,27.69 90 top
R23  22.96,9.14 0 top
R24  84.94,29.97 90 top
R25  95.35,29.97 90 top
R26  26.05,11.49 180 top
R27  14.88,58.5 270 top
R28  9.08,35.81 90 top
R29  6.41,35.91 90 top
S1  32.68,24.65 180 top
U1  18.64,18.29 180 top
Y1  58.3,14.9 270 top

### Tracks (layer width: path | path; a pad name or v marks a point on that pad's centre or on a via)
1_VC+
  Top 0.152: B2.AC1 97.52,33.57 97.54,33.55 97.66,33.43
  Top 0.61: 97.54,34.21 97.54,33.55 | 97.66,33.43 97.66,16.02 J1.7
1_VC-  (via drill 0.35)
  Top 0.152: B2.AC2 92.41,33.62 92.3,33.73
  Top 0.61: 92.3,34.06 92.3,33.73 92.3,27.76 91.95,27.41 91.95,25.23 v93.93,23.25
  Bottom 0.61: v93.93,23.25 93.95,23.23 84.43,13.72 J1.8
2_VC+  (via drill 0.35)
  Top 0.61: B1.AC2 85.31,33.47 86.77,32.02 86.77,30 90.42,26.34 90.42,24.13 92.24,22.32 92.24,20.08 v89.97,17.8
  Bottom 0.61: v89.97,17.8 89.97,17.27 95.06,12.18 J1.9
2_VC-
  Top 0.61: 88.14,33.3 88.06,33.22 | 88.14,33.3 91.19,30.25 91.19,24.62 93.37,22.43 93.37,20.02 85.55,12.19 84.23,12.19 J1.10 | B1.AC1 88.05,33.39 88.14,33.3
5V  (via drill 0.35)
  Top 0.406: v51.59,32.28 52.45,32.28 52.81,31.93 IC2.6
  Top 0.61: C20.1 37.29,31.24 37.29,33.83 C19.1 37.13,33.83 34.24,33.83 C21.1 34.09,33.98 v32.72,33.98 | v29.67,33.98 29.67,35.51 C23.+ | v43.66,32.94 42.95,32.23 41.05,32.23 40.05,33.23 R11.2 39.27,34.29 v39.27,34.9 | 63.96,52.27 66.4,52.27 C14.1 66.84,52.26 67.69,51.41 67.69,49.4 67.31,49.02 67.31,41.15 L1(74437336100).2 | 63.96,52.27 63.65,52.27 C15.1 | 63.96,52.27 63.96,56.54 JP1.1 62.41,56.64 60.22,58.83 48.72,58.83 D2.4 | 63.96,52.27 C15.1 | C15.1 61.78,52.26 59.61,50.09 v59.61,48.82 | IC3.1 58.43,44.77 60.52,44.77 60.96,45.21 60.96,48.02 60.16,48.82 v59.61,48.82 | 58.49,46.74 IC3.3 58.55,46.79 58.55,47.4 59.61,48.46 v59.61,48.82
  Bottom 0.61: v29.67,33.98 v32.72,33.98 38.35,33.98 v39.27,34.9 39.27,34.95 48.82,44.5 53.9,44.5 58.22,48.82 v59.61,48.82 | v43.66,32.94 46.51,32.94 47.17,32.28 v51.59,32.28
48V  (via drill 0.35)
  Top 0.152: 88.05,43.35 B1.+
  Top 0.254: 53.78,31.27 IC2.7
  Top 0.406: v47.04,31.27 53.78,31.27
  Top 0.61: D1.1 78.89,36.73 78.89,40.39 C9.1 77.53,40.45 77.51,40.47 76.86,41.12 73.23,41.12 L1(74437336100).1 73.21,43.08 72.54,43.74 v70.51,43.74 | v47.04,31.27 47.04,29.57 45.36,27.89 R5.2 | 85.95,45.54 85.93,45.57 JP3.1 88.05,43.35 | 97.54,42.82 97.52,42.84 | 97.52,42.84 94.82,45.54 85.95,45.54 | 85.93,45.54 85.95,45.54 | B2.+ 97.52,42.84
  Bottom 0.61: JP3.1 84.22,45.57 78.73,51.05 C13.+ 75.69,51.05 75.69,48.92 v70.51,43.74 58.04,31.27 v47.04,31.27
AUX
  Top 0.152: 59.69,32.61 IC2.16 | 62.89,32.61 C16.1
  Top 0.305: 62.89,32.61 59.69,32.61
COM_A_SHTKY
  Top 0.152: 42.62,56.69 D2.3 42.47,56.54 | 42.62,61.11 D2.1 | 35,51.51 Q2.4
  Top 0.61: 42.62,61.11 42.62,56.69 | D2.1 42.44,61.11 42.12,61.11 42.04,61.18 37.46,61.18 L2.1 | 35,51.51 37.44,51.51 42.47,56.54
COMP
  Top 0.152: 45.06,38.86 45.21,38.71 C11.2
  Top 0.406: IC2.3 51.23,33.88 46.44,38.67 C11.2
  Top 0.61: 45.06,38.86 R6.2
CSN_DWM  (via drill 0.35)
  Top 0.152: U1.27 | IC4.17
  Top 0.254: U1.27 13.47,20.04 13.25,20.26 13.25,32.59 v14.75,34.09
  Top 0.305: v21.99,52.24 IC4.17
  Bottom 0.254: v14.75,34.09 14.61,34.23 14.61,36.83 21.99,44.21
  Bottom 0.305: v21.99,52.24 21.99,44.21
FB
  Top 0.152: 45.34,40.55 C11.1 45.21,40.69 | 42.33,41.6 C10.1
  Top 0.406: IC2.2 52.04,34.54 46.04,40.55 45.34,40.55
  Top 0.61: 42.33,41.6 44.3,41.6 45.21,40.69
FREQ
  Top 0.152: 59.69,35.2 IC2.20 | 62.28,42.67 R8.2
  Top 0.305: 59.69,35.2 59.69,40.08 62.28,42.67
GATE
  Top 0.152: IC2.15 59.54,32 58.93,32 58.2,32.73 58.2,34.6 52.35,40.46 48.24,40.46 45.58,43.12 37.62,43.12 34.28,39.78 32.72,39.78 R10.1
GND  (via drill 0.35)
  Top 0.152: 28.82,40.12 25.24,37.62 C23.- | 21.89,41.03 IC4.8 21.89,40.88 | 12.9,34.59 C4.2 | IC4.23 13.46,54.46 | 12.29,54.29 IC4.24 | 13.51,54.29 IC4.23 | 16.26,54.29 IC4.21 16.41,54.44 | 13.67,54.29 IC4.23 | 24.18,52.46 IC4.16 24.33,52.46 | 22.25,40.39 22.04,40.39 21.89,40.39 | 84.84,30.94 R24.2 | 78.89,32.46 D1.2 78.74,32.46 | 78.77,42.6 79.15,42.22 78.89,42.22 C9.2 78.74,42.37 | 78.13,13.56 IC1.18 | 78.13,15.39 IC1.21 78.13,15.54 | 78.13,16 IC1.22 | R25.2 95.34,30.92 | C25.2 73.76,26.74 | 70.97,13.56 IC1.11 70.82,13.56 | 57.07,33.66 57.07,32.59 IC2.21 56.79,32.16 | 65.79,19.96 C27.2 | 70.82,19.2 IC1.2 | 65.18,7.62 R19.2 | 65.63,20.12 C27.2 | 4.87,10.63 D9.1 | U1.35 14.38,16.05 | 18.39,14.02 U1.42 18.39,14.17 | 19.86,9.43 C3.2 19.86,9.27 | 22.81,17.53 U1.5 22.96,17.53 | 25.86,20.88 C1.2 | 34.24,35.81 C21.2 | 37.13,35.81 C19.2 37.29,35.81 | 40.03,36.27 C18.2 | 37.29,29.41 C20.2 37.13,29.26 | 53.75,29.26 IC2.10 | R13.1 | 31.34,20.5 31.34,20.32 C6.2 | 65.79,20.12 C27.2 | 16.38,53.62 16.41,53.59 | 82.87,42.55 B1.- | 40.15,49.29 C7.1 40.31,49.49
  Top 0.254: v18.16,20.52 18.85,21.21 18.85,21.23 18.89,21.27 U1.18 | U1.35 12.7,16.04 | 12.69,16.05 12.7,16.04 | v7.09,14.87 8.26,16.04 12.7,16.04 | 69.14,13.51 70.85,13.51 IC1.11 70.95,13.53 72.54,13.53 72.74,13.73 72.96,13.73 | v75.35,13.57 75.35,14.58 76.17,15.4 76.17,15.39 78.13,15.39 | 22.04,40.39 21.99,40.39 IC4.8 | C1.2 27.3,20.76 27.3,18.23 26.68,17.6 24.8,17.6 24.65,17.45 24.55,17.54 U1.5 21.4,17.54 21.38,17.56
  Bottom 0.152: JP2.2 46.69,51.82 | 14.43,3.05 10-PIN-PROGRAMMER.9
  Bottom 0.254: v75.35,13.57 79.69,13.57 v79.7,13.58
  other vias: 53.39,45.44 50.83,49
  pour Top: 0.18,0.16 0.18,68.58 100.1,68.58 100.1,-0.03 0.13,-0.03 0.06,0.04
  pour Bottom: 0.1,0 100.1,0 100.1,68.7 0.01,68.7 0.01,0.1
GRN_CAT
  Top 0.406: R24.1 86.19,27.39 J1.13
GRN_LED
  Top 0.152: 78.28,18.75 IC1.26
  Top 0.406: 78.28,18.75 79.65,18.75 82.37,21.47 82.37,24.51 83.62,25.76 J1.14
IRQ
  Top 0.152: R27.2 | 14.88,54.44 14.95,54.37 IC4.22
  Top 0.254: U1.30 11.42,18.54 4.35,25.6 4.35,41.41 14.94,52 14.95,51.99 14.95,54.37
  Top 0.305: 14.88,54.44 R27.2
MISO1_MC
  Top 0.152: U1.21 | 15.95,26.67 R20.1
  Top 0.254: 15.95,26.67 15.95,24.87 17.4,23.42 U1.21
MISO2_DWM  (via drill 0.35)
  Top 0.152: U1.28 | 19.3,54.29 IC4.19
  Top 0.254: U1.28 13.2,19.53 12.28,20.45 v12.28,33.24
  Top 0.305: 19.3,54.29 v19.3,50.44
  Bottom 0.254: v12.28,33.24 12.28,35.87 19.49,43.09 19.49,50.26 v19.3,50.44
MOSI1_MC
  Top 0.152: R21.1 20.93,26.42 | 18.39,22.55 U1.19
  Top 0.254: 18.39,22.55 18.39,23.88 20.93,26.42
MOSI2_DWM  (via drill 0.35)
  Top 0.152: 20.52,54.29 IC4.18
  Top 0.254: v14.95,32.97 14.41,32.97 13.77,32.34 13.77,21 U1.25 | 20.52,54.29 20.52,51.18 v20.41,51.06
  Bottom 0.254: v14.95,32.97 14.76,32.97 13.51,34.22 13.51,36.42 20.41,43.32 v20.41,51.06
N$1
  Top 0.152: C3.1 19.86,12.04 18.92,12.98 18.92,14.03 U1.43
N$2
  Top 0.305: IC2.8 50.52,30.63 45.86,25.97 R5.1
N$3
  Top 0.152: 53.9,29.87 IC2.9
  Top 0.305: IC2.9 51.59,29.97 49.05,27.43 49.05,26.27 R7.2
N$4
  Top 0.152: 70.82,26.98 R16.1 | 73.41,28.96 C25.1 73.56,28.96 | J1.6 83.77,23.47 83.77,23.77 84.93,24.93 84.93,26.6 82.32,29.21 L1.1 | 70.82,29.26 70.82,28.96 R15.2 70.82,29.26
  Top 0.254: L1.1 73.83,29.21 C25.1
  Top 0.305: 70.82,26.98 70.82,28.96 73.41,28.96
N$5
  Top 0.152: R6.1 40.03,40.92 C10.2
N$6  (via drill 0.35)
  Top 0.152: 66.68,12.13 66.67,12.13 R17.2 67.01,12.19 67.46,12.19 | 64.15,15.01 R18.1
  Top 0.305: C26.1 66.68,12.13 | v66.88,14.99 66.87,15.01 64.15,15.01 | v68.22,12.95 67.46,12.19
  Bottom 0.305: J1.3 84.53,20.73 78.85,15.05 66.94,15.05 v66.88,14.99 68.22,13.65 v68.22,12.95
N$7
  Top 0.152: 32.72,41.6 R10.2 | 32.72,45.11 Q2.1
  Top 0.305: 32.72,45.11 32.72,41.6
N$8
  Top 0.152: 67.16,7.62 R19.1 | 70.97,11.43 IC1.14
  Top 0.406: 70.97,11.43 67.16,7.62
N$9
  Top 0.61: R3.1 46.21,44.7 46.73,44.18 D3.A
N$10
  Top 0.152: 45.21,32 R12.1
  Top 0.61: R13.2 43.69,30.48 45.21,32
N$11
  Top 0.305: R14.1 D4.A
N$12
  Top 0.305: R26.1 27.03,11.52 27.03,11.5 D5.A
N$13
  Top 0.305: D6.A 9.08,32.78 R28.1
N$14
  Top 0.305: D7.A 6.46,34.91 R29.1
N$15
  Top 0.152: D9.4 D8.1
N$18
  Top 0.61: IC3.4 55.84,46.7 55.84,47.8 C22.2
OSC1  (via drill 0.35)
  Top 0.152: 78.13,16.61 IC1.23
  Top 0.254: C28.1 58.09,19.93 Y1.1 60.67,17.36 v60.67,15.76
  Top 0.305: v76.3,16.61 78.13,16.61
  Bottom 0.305: v76.3,16.61 76.3,16.2 75.88,15.78 60.7,15.78 v60.67,15.76
OSC2  (via drill 0.35)
  Top 0.254: Y1.2 58.3,10.24 | v58.95,15.84 58.95,11.46 58.3,10.81 Y1.2 | C29.1 57.54,9.31 Y1.2
  Top 0.305: IC1.24 75.23,17.37 v75.18,17.42
  Bottom 0.305: v75.18,17.42 74.22,16.46 59.56,16.46 v58.95,15.84
RESET
  Top 0.152: U1.40
  Top 0.305: U1.40 17.4,12.72 16.97,12.3 R4.1 | U1.40 17.4,16.96 22.62,22.19 29.75,22.19 S1.1 S1.4
  Top 0.406: R4.1 16.52,11.34 14.43,9.24 14.43,5.64 10-PIN-PROGRAMMER.10
RSP
  Top 0.152: R9.2 63.8,29.16 63.8,43.13 63.2,43.74 60.86,43.74 58.12,40.99 48.59,40.99 45.14,44.45 37.93,44.45 Q2.3 37.7,45.81
  Top 0.305: IC2.12 61.57,29.97 R9.2
RST_DWM
  Top 0.152: 14.27,19.05 U1.29 | 14.88,40.88 IC4.3
  Top 0.254: 14.27,19.05 12.85,19.05 11.4,20.5 11.4,37.38 11.98,37.95 14.42,37.95 14.88,38.41 14.88,40.88
RTN  (via drill 0.35)
  Top 0.152: 62.43,44.65 R8.1 62.43,44.5 | 63.5,50.29 C15.2 63.65,50.44 | 66.4,50.44 C14.2 | 59.69,31.24 IC2.14 | 59.69,30.63 IC2.13 | 57.71,26.98 C12.2 | 64.87,32.61 C16.2 64.9,32.42 | 64.87,34.75 C17.2 64.72,34.9 | 63.45,24.16 63.14,24.06 R9.1
  Top 0.305: IC2.17 58.83,33.22 58.62,33.43 58.62,34.31 58.85,34.54 IC2.19 59.69,34.52 60.43,34.52 62.99,37.08 v62.99,37.69 | 59.26,29.34 58.8,29.34 58.5,29.64 58.5,30.43 58.7,30.63 IC2.13 | 59.26,29.34 IC2.11 59.66,28.85 63.14,25.38 63.14,24.06 | 59.69,30.63 59.69,31.24 | 57.71,26.98 57.71,27.79 59.26,29.34 | 63.45,24.16 64.9,25.6 64.9,32.59 64.87,32.61
  Top 0.406: 62.43,44.65 62.43,49.23 63.5,50.29 | 63.65,50.44 66.4,50.44 | 64.87,34.75 64.87,32.61 | 62.43,44.5 63.7,44.5 64.41,43.79 v64.41,42.98 64.72,42.67 64.72,34.9
  Bottom 0.152: v64.41,42.98 64.41,43
  Bottom 0.305: v64.41,42.98 64.41,40.97 62.99,39.55 v62.99,37.69 | C13.- 72.24,50.83 64.41,43
RX_MC
  Top 0.254: U1.16 19.9,23.99 20.33,24.42 21.05,25.14 23.64,25.14 JP4.1
RXLED_DWM
  Top 0.152: 24.21,48.26 IC4.13
  Top 0.305: R29.2 6.41,38.71 15.96,48.26 24.21,48.26
RXLED_MC
  Top 0.305: 24.82,13.62 D5.C 21.93,13.5 U1.48
SCK1_MC
  Top 0.152: U1.20 | 17.88,26.16 18.39,26.67 R22.1
  Top 0.254: 17.88,26.16 U1.20
SCK2_DWM
  Top 0.152: U1.26 14.43,20.57 15.33,20.57 15.57,20.82 15.57,21.3 14.43,22.44 14.43,30.38 16.31,32.26 18.48,32.26 26.75,40.53 26.75,53.78 24.18,56.35 18.26,56.35 17.79,55.87 IC4.20
SCK_ETH  (via drill 0.35)
  Top 0.152: R22.2 18.39,28.86 | 70.88,15.44 IC1.8
  Top 0.305: 18.39,28.86 19.27,29.74 22.04,29.74 v22.44,29.33 | v67.17,18.23 67.17,18.12 69.85,15.44 70.88,15.44
  Bottom 0.305: v22.44,29.33 25.63,29.33 36.73,18.23 v67.17,18.23
SEN
  Top 0.152: 42.01,36.27 C18.1 | 45.36,33.83 R12.2 45.21,33.98 | 42.01,33.98 42.01,33.53 R11.1 42.01,33.98
  Top 0.406: IC2.4 47.37,33.22 46.76,33.83 45.36,33.83
  Top 0.61: 42.01,36.27 42.01,33.98 45.21,33.98
SI_ETH  (via drill 0.35)
  Top 0.152: 20.98,28.5 R21.2
  Top 0.305: v27.45,28.5 20.98,28.5 | v68.41,18.01 68.41,17.62 69.95,16.08 IC1.7
  Bottom 0.305: v27.45,28.5 57.92,28.5 v68.41,18.01
SO_ETH  (via drill 0.35)
  Top 0.152: 70.82,16.76 IC1.6
  Top 0.305: v17.48,30.18 16.51,30.18 15.85,29.52 R20.2 | v69.3,18.45 69.3,17.41 69.95,16.76 70.82,16.76
  Bottom 0.305: v17.48,30.18 57.57,30.18 v69.3,18.45
SWCLK
  Top 0.152: 22.05,9.14 R23.1 21.89,9.14 21.89,11.1 19.9,13.09 19.9,14.03 U1.45
  Top 0.406: 22.05,9.14 22.05,5.64 10-PIN-PROGRAMMER.4
SWDIO
  Top 0.152: U1.46 20.39,13.2 22.97,10.62 22.97,7.15 24.49,5.64 10-PIN-PROGRAMMER.2
TMR
  Top 0.152: 54.58,35.18 IC2.1 | 55.73,26.98 C12.1
  Top 0.305: 54.58,35.18 55.07,34.7 55.07,27.64 55.73,26.98
TPIN+  (via drill 0.35)
  Top 0.152: 67.01,10.36 R17.1 | v72.66,12.77 72.08,12.19 70.97,12.19 IC1.13
  Top 0.406: 67.01,10.36 67.94,10.36 69.75,12.17 IC1.13
  Bottom 0.152: v72.66,12.77 80.23,12.77 88.19,20.73 88.65,20.73 J1.1
TPIN-  (via drill 0.35)
  Top 0.152: 63.94,16.61 R18.2 | IC1.12
  Top 0.305: 63.94,16.61 67.77,16.61 69.43,14.95 v69.43,14.28 | v69.25,12.83 IC1.12
  Bottom 0.305: J1.2 86.66,20.73 80.22,14.28 v69.43,14.28 69.25,14.11 v69.25,12.83
TPOUT+
  Top 0.152: R15.1 70.82,31.09 79.81,31.09 80.87,30.02 85.75,30.02 87.63,28.14 87.63,25.32 86.74,24.43 86.18,24.43 85.69,23.95 J1.5 85.69,23.72 | 78.13,12.8 IC1.17
  Top 0.254: 83.06,21.66 83.44,22.04 84.37,22.04 J1.5
  Top 0.305: IC1.17 80.3,12.83 83.06,15.58 83.06,21.66
TPOUT-  (via drill 0.35)
  Top 0.152: 70.82,24.84 R16.2
  Top 0.305: v72.34,24.84 70.82,24.84 | IC1.16 82.15,12.17 82.82,12.83 82.82,14.12 87.45,18.74 88.64,18.74 90.01,20.11 90.01,21.98 88.62,23.37 J1.4
  Bottom 0.152: 87.58,23.47 J1.4
  Bottom 0.305: v72.34,24.84 83.01,24.84 83.31,24.54 86.51,24.54 87.58,23.47
TX_MC
  Top 0.254: U1.15 20.41,22.54 20.41,22.53 20.41,23.46 20.52,23.57 26.03,23.57 26.63,24.17 JP4.2
TXLED_DWM  (via drill 0.35)
  Top 0.254: v10.57,38.59 9.08,37.1 R28.2
  Top 0.305: v18.33,43.93 19.19,43.93 21.84,46.93 IC4.12
  Top 0.61: R28.2 9.08,36.98
  Bottom 0.305: v18.33,43.93 13.36,38.96 10.94,38.96 v10.57,38.59
TXLED_MC
  Top 0.305: D4.C 12.68,10.65 | 12.68,10.65 12.68,10.85 | U1.39 16.89,13.22 16.34,12.66 15.9,12.66 13.91,10.67 12.7,10.67 12.68,10.65
USB+
  Top 0.254: D9.2 4.09,11.68 4.09,9.61 5.49,8.22 5.49,6.1 5.82,5.77 J2.3
  Top 0.305: U1.34 7.43,16.54 4.8,13.91 D9.2
USB-
  Top 0.152: 5.16,5.03 5.16,5.23 5.17,5.22 J2.2 | U1.33
  Top 0.254: 5.16,5.23 5.16,5.61 5.05,5.71 5.05,7.87 3.57,9.36 3.57,11.23 2.9,11.65 D9.3
  Top 0.305: U1.33 6.11,17.04 2.9,13.84 D9.3
VBIAS
  Top 0.152: 62.89,34.75 C17.1
  Top 0.305: IC2.18 62.03,33.88 62.89,34.75
VBUS
  Top 0.152: 3,7.47 D8.2 | J2.1 4.52,5.24 4.5,5.26
  Top 0.254: 4.5,5.26 4.5,5.13
  Top 0.406: 3,7.47 3.48,7.47 4.52,6.43 J2.1
VCAP
  Top 0.152: 67.61,19.96 C27.1
  Top 0.305: IC1.1 67.61,19.96
VCC  (via drill 0.35)
  Top 0.152: 24.49,3.15 10-PIN-PROGRAMMER.1
  Top 0.254: U1.36 14.08,15.54 10.01,15.54 | 19.41,14.06 U1.44 | U1.6
  Top 0.305: 76.64,14.12 IC1.19 | IC1.15 78.12,11.5 76.7,11.5 | 19.41,14.06 19.41,14.99 19.76,15.34 21.59,15.34 22.42,14.51 28.78,14.51 29.36,13.94 29.36,11.23 28.21,10.08 24.58,10.08 23.91,9.41 R23.2 23.82,9.24 | U1.6 24.99,18.03 25.7,18.75 | 19.56,21 19.41,21.15 19.41,22.52 U1.17 | U1.6 19.99,18.03 v19.46,17.5 | IC1.28 77.61,19.96 77.6,19.96 | 24.97,11.36 R26.2 | R14.2 14.08,14.6 14.08,15.54
  Top 0.406: IC1.19 78.13,14.17 78.13,14.78 IC1.20 79.21,14.78 | 79.47,20.52 78.92,19.96 IC1.28 78.12,19.92 | 72.29,14.11 70.9,14.11 IC1.10 | IC1.25 79.26,18.03 | 10.01,15.54 8.47,14 | 78.13,18.01 IC1.25 | 77.6,19.96 77.1,19.96 | IC1.25 78.13,18.06 77.06,18.06 | 23.82,9.24 23.82,10.91 24.27,11.36 24.97,11.36
  Top 0.61: L1.2 79.47,23.5 79.47,20.52 | 72.29,14.11 73.08,14.89 73.08,23.44 L1.2 | 79.21,14.78 79.62,15.19 79.62,17.68 79.26,18.03 | 49.17,51.82 JP2.1 49.12,47.81 R3.2 48.34,46.56 53.95,46.56 55.77,44.74 | 8.47,14 8.47,8.21 12.36,4.32 14.78,4.32 15.54,5.08 15.54,7.79 16.97,9.22 R4.2 16.97,9.03 18.14,7.87 18.14,2.08 18.75,1.47 22.91,1.47 10-PIN-PROGRAMMER.1 24.56,2.97 27.71,2.97 35.64,10.9 48.13,10.9 53.67,5.36 68.02,5.36 74.22,11.55 74.22,20.91 76.27,22.96 76.27,26.64 L1.2 | C4.1 14.94,36.51 v16.27,35.19 16.27,36.75 19.19,39.67 IC4.6 | IC4.6 19.19,40.87 19.13,40.93 | 25.7,18.75 C1.1 | v19.51,20.95 19.56,21 | R23.2 25.65,9.14 26.37,8.43 26.37,5.03 24.49,3.15 | 77.06,18.06 76.81,18.31 76.81,19.67 77.1,19.96 | v43.28,53.75 43.28,52.39 C8.2 43.01,50.62 C7.2 | 55.77,44.74 IC3.5 | 76.7,11.5 76.4,11.8 76.4,13.88 76.64,14.12 | 20.56,40.05 20.56,39.54 | 20.56,39.54 20.56,38.61 C2.1 | 20.56,39.54 20.59,39.56 IC4.7 IC4.6 | C24.1 55.77,43.7 55.77,44.74
  Bottom 0.61: 10-PIN-PROGRAMMER.1 23.24,4.29 23.24,6.27 19.46,10.06 v19.46,17.5 19.51,17.55 v19.51,20.95 20.47,20.95 20.47,24.48 16.28,28.67 16.28,35.17 v16.27,35.19 16.27,36.97 33.05,53.75 v43.28,53.75 48.24,53.75 49.12,52.87 JP2.1
XTAL1
  Top 0.152: 22.96,15.54 U1.1
  Top 0.305: 30.05,16.34 30.18,16.34 | C5.1 31.61,17.89 30.05,16.34 | 30.05,16.34 29.67,15.96 Q1.2 28.97,15.54 22.96,15.54
XTAL2
  Top 0.152: 22.91,16.05 U1.2 | 29.36,20.26 C6.1
  Top 0.305: 29.36,20.26 29.36,18.03 Q1.1 28.64,18.46 26.24,16.05 22.91,16.05
YEL_CAT
  Top 0.152: 95.81,25.91 J1.11
  Top 0.406: R25.1 95.35,26.36 95.81,25.91
YEL_LED  (via drill 0.35)
  Top 0.152: 78.28,19.36 IC1.27
  Top 0.406: 78.28,19.36 79.27,19.36 81.33,21.41 v81.33,22.06
  Bottom 0.406: v81.33,22.06 81.34,22.07 89.53,22.07 93.22,25.76 J1.12